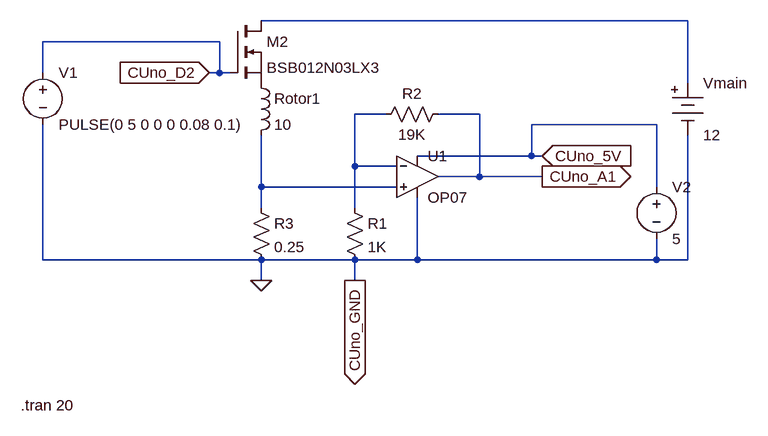
[diagram p0: schematic RotorSystems.asc]
RotorSystems.asc, the LTspice schematic file:
Version 4
SHEET 1 1112 680
WIRE 576 -64 -80 -64
WIRE -144 -32 -416 -32
WIRE -416 16 -416 -32
WIRE -144 16 -144 -32
WIRE -144 16 -160 16
WIRE -128 16 -144 16
WIRE 576 32 576 -64
WIRE 112 80 64 80
WIRE 256 80 192 80
WIRE 528 96 336 96
WIRE 336 144 336 96
WIRE 336 144 160 144
WIRE 352 144 336 144
WIRE 64 160 64 80
WIRE 128 160 64 160
WIRE 256 176 256 80
WIRE 256 176 192 176
WIRE 352 176 256 176
WIRE -80 192 -80 112
WIRE 128 192 -80 192
WIRE 528 192 528 96
WIRE -80 224 -80 192
WIRE 64 224 64 160
WIRE -416 304 -416 96
WIRE -80 304 -416 304
WIRE 64 304 -80 304
WIRE 160 304 160 208
WIRE 160 304 64 304
WIRE 528 304 528 272
WIRE 528 304 160 304
WIRE 576 304 576 112
WIRE 576 304 528 304
WIRE -80 336 -80 304
WIRE 64 336 64 304
FLAG 352 176 CUno_A1
IOPIN 352 176 Out
FLAG -80 336 0
FLAG 352 144 CUno_5V
IOPIN 352 144 In
FLAG -160 16 CUno_D2
IOPIN -160 16 In
FLAG 64 336 CUno_GND
IOPIN 64 336 Out
SYMBOL Opamps\\OP07 160 112 R0
SYMATTR InstName U1
SYMBOL res 208 64 R90
WINDOW 0 0 56 VBottom 2
WINDOW 3 32 56 VTop 2
SYMATTR InstName R2
SYMATTR Value 19K
SYMBOL res 48 208 R0
SYMATTR InstName R1
SYMATTR Value 1K
SYMBOL res -96 208 R0
SYMATTR InstName R3
SYMATTR Value 0.25
SYMBOL ind -96 16 R0
SYMATTR InstName Rotor1
SYMATTR SpiceLine Rser=15
SYMATTR Value 10
SYMBOL nmos -128 -64 R0
SYMATTR InstName M2
SYMATTR Value BSB012N03LX3
SYMBOL Misc\\battery 576 16 R0
WINDOW 123 0 0 Left 2
WINDOW 39 0 0 Left 2
SYMATTR InstName Vmain
SYMATTR Value 12
SYMBOL voltage -416 0 R0
WINDOW 123 0 0 Left 2
WINDOW 39 0 0 Left 2
SYMATTR InstName V1
SYMATTR Value PULSE(0 5 0 0 0 0.08 0.1)
SYMBOL voltage 528 176 R0
WINDOW 123 0 0 Left 2
WINDOW 39 0 0 Left 2
SYMATTR InstName V2
SYMATTR Value 5
TEXT -450 528 Left 2 !.tran 20

The netlist it stands for:
* RotorSystems.asc
XU1 N003 N002 CUno_5V 0 CUno_A1 LT1001  ; OP07, pins In+ In- V+ V- OUT
R2 CUno_A1 N002 19K
R1 N002 0 1K
R3 N003 0 0.25
L§Rotor1 P001 N003 10 Rser=15
M2 N001 CUno_D2 P001 P001 BSB012N03LX3
Vmain N001 0 12
V1 CUno_D2 0 PULSE(0 5 0 0 0 0.08 0.1)
V2 CUno_5V 0 5
.model NMOS NMOS
.model PMOS PMOS
.lib standard.mos
.tran 20
.lib LTC.lib
.backanno
.end